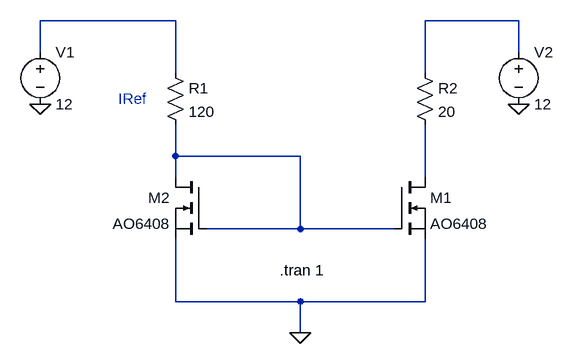
[diagram p0: schematic Current_Mirroring.asc]
Current_Mirroring.asc, the LTspice schematic file:
Version 4.1
SHEET 1 880 680
WIRE 32 -160 -176 -160
WIRE 560 -160 416 -160
WIRE -176 -112 -176 -160
WIRE 560 -112 560 -160
WIRE 32 -80 32 -160
WIRE 416 -80 416 -160
WIRE 32 48 32 0
WIRE 224 48 32 48
WIRE 32 80 32 48
WIRE 416 80 416 0
WIRE 224 160 224 48
WIRE 224 160 80 160
WIRE 368 160 224 160
WIRE 32 272 32 176
WIRE 224 272 32 272
WIRE 416 272 416 176
WIRE 416 272 224 272
WIRE 224 320 224 272
FLAG -176 -32 0
FLAG 560 -32 0
FLAG 224 320 0
SYMBOL nmos 368 80 R0
SYMATTR InstName M1
SYMATTR Value AO6408
SYMBOL voltage -176 -128 R0
WINDOW 123 0 0 Left 0
WINDOW 39 0 0 Left 0
SYMATTR InstName V1
SYMATTR Value 12
SYMBOL voltage 560 -128 R0
WINDOW 123 0 0 Left 0
WINDOW 39 0 0 Left 0
SYMATTR InstName V2
SYMATTR Value 12
SYMBOL res 16 -96 R0
SYMATTR InstName R1
SYMATTR Value 120
SYMBOL res 400 -96 R0
SYMATTR InstName R2
SYMATTR Value 20
SYMBOL nmos 80 80 M0
SYMATTR InstName M2
SYMATTR Value AO6408
TEXT -56 -40 Left 2 ;IRef
TEXT 192 224 Left 2 !.tran 1

The netlist it stands for:
* Current_Mirroring.asc
M1 N004 N003 0 0 AO6408
V1 N001 0 12
V2 N002 0 12
R1 N001 N003 120
R2 N002 N004 20
M2 N003 N003 0 0 AO6408
.model NMOS NMOS
.model PMOS PMOS
.lib standard.mos
* IRef
.tran 1
.backanno
.end